# Altium schematic sheet 111.SchDoc
size A4
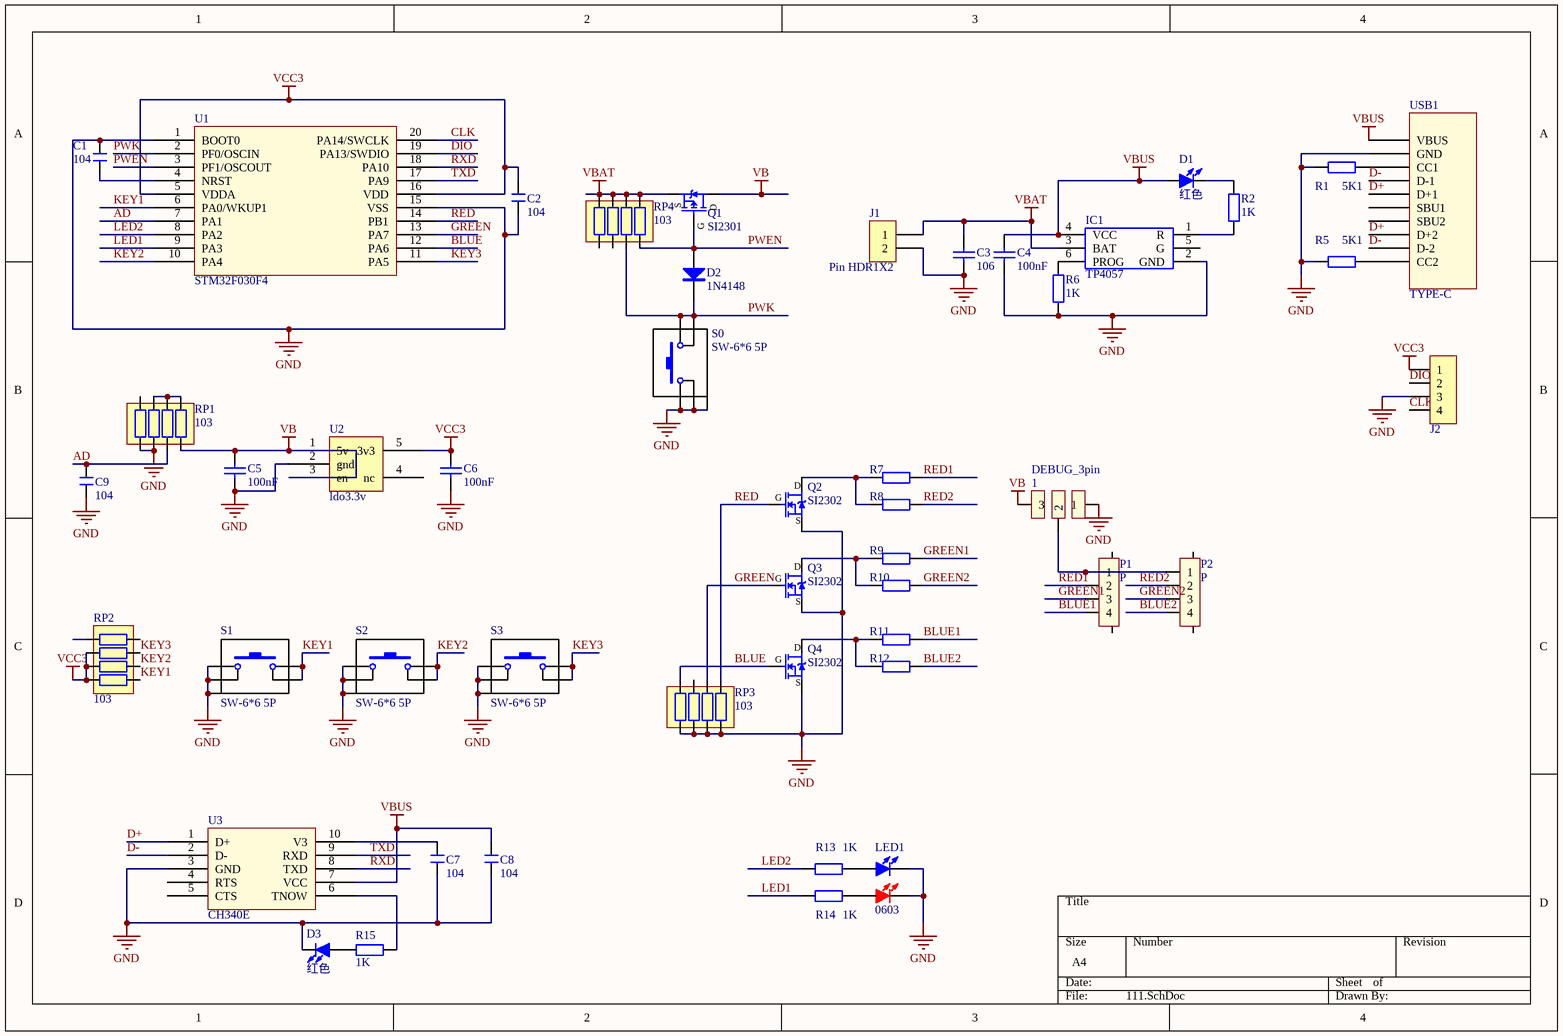
[diagram p0: 111.SchDoc]

## Parts
1  DEBUG_3pin  [DEBUG_3pim]
C1  104  [C 0402_M]
C2  104  [C 0402_M]
C3  value 106  [C-RAD-0805]  (hidden comment: Cap)
C4  value 100nF  [C-RAD-0603]  (hidden comment: Cap)
C5  value 100nF  [C-RAD-0603]  (hidden comment: Cap)
C6  value 100nF  [C-RAD-0603]  (hidden comment: Cap)
C7  104  [C 0402_M]
C8  104  [C 0402_M]
C9  104  [C 0402_M]
D1  红色  [LED 0603R]
D2  1N4148  [SOD-323]
D3  红色  [LED 0603R]
IC1  TP4057  [SOT23-6M]
J1  Pin HDR1X2  [Pin HDR1X2/2.54mm-S]
J2  HDR-1X4  [HDR2.0-LI-4P]  (value not drawn)
LED1  0603  [LED 0603-RG]
P1  P  [SH1.0_4pin]
P2  P  [SH1.0_4pin]
Q1  SI2301  [SOT23-3N]
Q2  SI2302  [SOT23-3N]
Q3  SI2302  [SOT23-3N]
Q4  SI2302  [SOT23-3N]
R1  5K1  [R 0402_M]
R2  1K  [R 0402_M]
R5  5K1  [R 0402_M]
R6  1K  [R 0402_M]
R7  Res1  [0603-1]  (value not drawn)
R8  Res1  [0603-1]  (value not drawn)
R9  Res1  [0603-1]  (value not drawn)
R10  Res1  [0603-1]  (value not drawn)
R11  Res1  [0603-1]  (value not drawn)
R12  Res1  [0603-1]  (value not drawn)
R13  1K  [R 0402_M]
R14  1K  [R 0402_M]
R15  1K  [R 0402_M]
RP1  103  [RCA-8P4R-0402]
RP2  103  [RCA-8P4R-0402]
RP3  103  [RCA-8P4R-0402]
RP4  103  [RCA-8P4R-0402]
S0  SW-6*6 5P  [SW6*6]
S1  SW-6*6 5P  [SW6*6]
S2  SW-6*6 5P  [SW6*6]
S3  SW-6*6 5P  [SW6*6]
U1  STM32F030F4  [TSSOP20]
U2  ldo3.3v  [SOT23-5]
U3  CH340E  [MSOP10_M]
USB1  TYPE-C  [TYPE-C]

## Nets
GND: 1.1 C1.2 C2.1 C3.1 C4.1 C5.1 C6.1 C7.1 C8.1 C9.1 D3.2(K) IC1.2(GND) J1.2 J2.3 LED1.3 LED1.4 Q2.2(S) Q3.2(S) Q4.2(S) R1.2 R5.2 R6.1 RP1.1 RP1.2 RP3.1 RP3.2 RP3.3 RP3.4 S0.1 S0.4 S0.5 S1.1 S1.4 S1.5 S2.1 S2.4 S2.5 S3.1 S3.4 S3.5 U1.1(BOOT0) U1.15(VSS) U2.2(gnd) U3.3(GND) USB1.GND
VB: 1.3 C5.2 Q1.3(D) RP1.4 U2.1(5v) U2.3(en)
VBAT: C3.2 IC1.3(BAT) J1.1 Q1.2(S) RP4.5 RP4.6 RP4.7 RP4.8
VBUS: C4.2 C8.2 D1.1(A) IC1.4(VCC) U3.7(VCC) USB1.VBUS
VCC3: C2.2 C6.2 J2.1 RP2.6 RP2.7 RP2.8 U1.5(VDDA) U1.16(VDD) U2.5(3v3)
AD: C9.2 RP1.3 U1.7(PA1)
BLUE: Q4.1(G) RP3.8 U1.12(PA6)
BLUE1: P1.4 R11.2
BLUE2: P2.4 R12.2
CLK: J2.4 U1.20(PA14/SWCLK)
D+: U3.1(D+) USB1.D+1 USB1.D+2
D-: U3.2(D-) USB1.D-1 USB1.D-2
DIO: J2.2 U1.19(PA13/SWDIO)
GREEN: Q3.1(G) RP3.6 U1.13(PA7)
GREEN1: P1.3 R9.2
GREEN2: P2.3 R10.2
KEY1: RP2.1 S1.2 S1.3 U1.6(PA0/WKUP1)
KEY2: RP2.2 S2.2 S2.3 U1.10(PA4)
KEY3: RP2.3 S3.2 S3.3 U1.11(PA5)
LED1: R14.1 U1.9(PA3)
LED2: R13.1 U1.8(PA2)
PWEN: D2.A Q1.1(G) RP4.4 U1.3(PF1/OSCOUT)
PWK: D2.K RP4.3 S0.2 S0.3 U1.2(PF0/OSCIN)
RED: Q2.1(G) RP3.5 U1.14(PB1)
RED1: P1.2 R7.2
RED2: P2.2 R8.2
RXD: U1.18(PA10) U3.8(TXD)
TXD: U1.17(PA9) U3.9(RXD)
Net1_2: 1.2 P1.1 P2.1
NetC1_1: C1.1 U1.4(NRST)
NetC7_2: C7.2 U3.10(V3)
NetD1_2: D1.2(K) R2.2
NetD3_1: D3.1(A) R15.2
NetIC1_1: IC1.1(R) R2.1
NetIC1_6: IC1.6(PROG) R6.2
NetLED1_1: LED1.1 R13.2
NetLED1_2: LED1.2 R14.2
NetQ2_3: Q2.3(D) R7.1 R8.1
NetQ3_3: Q3.3(D) R9.1 R10.1
NetQ4_3: Q4.3(D) R11.1 R12.1
NetR1_1: R1.1 USB1.CC1
NetR5_1: R5.1 USB1.CC2
NetR15_1: R15.1 U3.6(TNOW)
NetRP1_5: RP1.5 RP1.6 RP1.7

Not connected (* = marked no-connect by the designer): IC1 5(G); P1 0; P2 0; RP1 8; RP2 4 5; RP3 7; RP4 1 2; U2 4(nc); U3 4(RTS) 5(CTS); USB1 SBU1 SBU2

## Library data of the parts
C1 C2 C7-C9 = C: 无极性贴片电容; 版权归属: 源创客; 材质: X7R; BOM名称: 无极性贴片电容; 学习资源: www.ooocke.com
C3-C6 = Cap: 无极性电容; Published: 8-Jun-2000; LatestRevisionDate: 17-Jul-2002; LatestRevisionNote: Re-released for DXP Platform.; PackageReference: RAD-0.3; Publisher: Altium Limited
D1 D3 = LED-SMD: 贴片LED; 版权归属: 源创客; BOM名称: 贴片LED; 学习资源: www.ooocke.com
D2 = 1N4148: 高速开关二极管; 版权归属: 源创客; BOM名称: 高速开关二极管; 学习资源: www.ooocke.com
J2 = Header 4: 4P接插件; 版权归属: 源创客; BOM名称: 4P接插件; 学习资源: www.ooocke.com
LED1 = LED-SMD-RG: 贴片双色LED; 版权归属: 源创客; BOM名称: 贴片双色LED; 学习资源: www.ooocke.com
P1 P2 = SH1.0-4
Q1 = SI2301: P沟道 20V/2.8A; BOM名称: 场效应管; 版权归属: 源创客; 学习资源: www.ooocke.com; 描述: P沟道 20V/2.8A
Q2-Q4 = SI2302: N沟道 20V/3A; BOM名称: 场效应管; 版权归属: 源创客; 学习资源: www.ooocke.com; 描述: N沟道 20V/3A
R1 R2 R5 R6 R13-R15 = R: 贴片电阻; 版权归属: 源创客; BOM名称: 贴片电阻; 学习资源: www.ooocke.com
R7-R12 = Res1: 贴片电阻; Published: 8-Jun-2000; LatestRevisionDate: 17-Jul-2002; LatestRevisionNote: Re-released for DXP Platform.; PackageReference: AXIAL-0.4; Publisher: Altium Limited
RP1-RP4 = R-8P4R: 贴片网络排阻; 版权归属: 源创客; BOM名称: 贴片网络排阻; 学习资源: www.ooocke.com
S0-S3 = SW-6*6 5P: 微动开关; Published: 24-Mar-1999; LatestRevisionDate: 17-Jul-2002; LatestRevisionNote: Re-released for DXP Platform.; PackageReference: SPST-2; Publisher: Altium Limited
U2 = Component_1
USB1 = USB-C